# Altium project DRIVER MOTION_A.PrjPcb (part 2 of 2)

## Sheet [10]_MOT_tH-BDIGDE FOC.SchDoc
size A3; DocumentNumber: 10; SheetNumber: 10; SheetTotal: 12; Ngu?i ki?m tra: bangdd; Ngu?i thi?t k?: thannt114
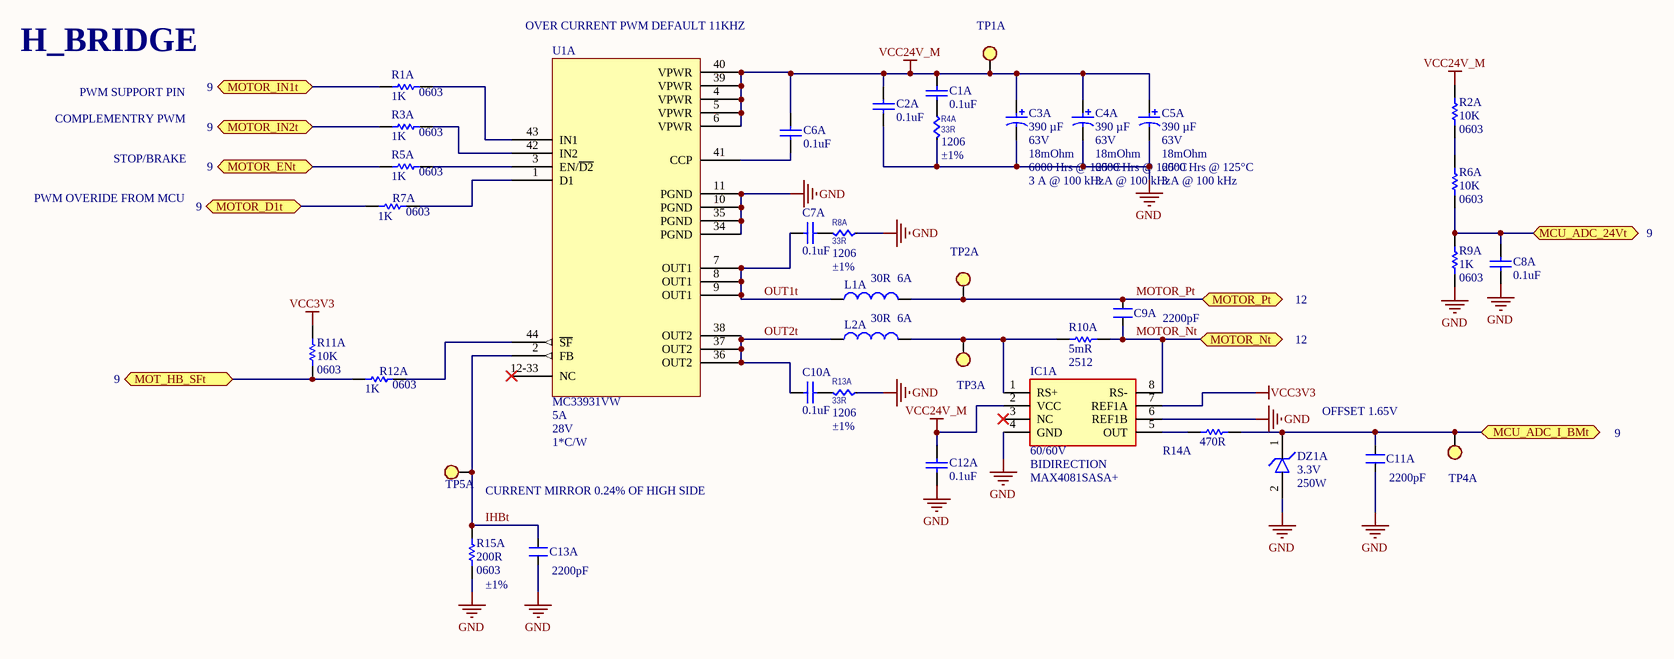
[diagram p6: [10]_MOT_tH-BDIGDE FOC.SchDoc]

### Parts
C1A  0.1uF  [CAP 0603]
C2A  0.1uF  [CAP 0603]
C3A  CPACITANCE: 390 µF  VOLTAGE: 63V  ESR: 18mOhm  Lifetime @ Temp.: 6000 Hrs @ 125°C  RIPPLE CURRENT: 3 A @ 100 kHz  [MAL218397005E3]  (hidden comment: HTK-35V391MHC5E-R2)
C4A  CPACITANCE: 390 µF  VOLTAGE: 63V  ESR: 18mOhm  Lifetime @ Temp.: 6000 Hrs @ 125°C  RIPPLE CURRENT: 3 A @ 100 kHz  [MAL218397005E3]  (hidden comment: HTK-35V391MHC5E-R2)
C5A  CPACITANCE: 390 µF  VOLTAGE: 63V  ESR: 18mOhm  Lifetime @ Temp.: 6000 Hrs @ 125°C  RIPPLE CURRENT: 3 A @ 100 kHz  [MAL218397005E3]  (hidden comment: HTK-35V391MHC5E-R2)
C6A  0.1uF  [CAP 0603]
C7A  0.1uF  [CAP 0603]
C8A  0.1uF  [CAP 0603]
C9A  2200pF  [CAP 0603]
C10A  0.1uF  [CAP 0603]
C11A  2200pF  [CAP 0603]
C12A  0.1uF  [CAP 0603]
C13A  2200pF  [CAP 0603]
DZ1A  Voltage - Reverse Standoff: 3.3V  Power - Peak Pulse: 250W  [SOD-323]  (hidden comment: ESD8351HT1G)
IC1A  GAIN: 60/60V  FUNCTION: BIDIRECTION  [8-SOIC]  (hidden comment: MAX4081SASA+)
L1A  Current: 6A  [R0805]  (hidden comment: 30R)
L2A  Current: 6A  [R0805]  (hidden comment: 30R)
R1A  PCB Footprint: 0603  [res 0603]  (hidden comment: 1K)
R2A  PCB Footprint: 0603  [res 0603]  (hidden comment: 10K)
R3A  PCB Footprint: 0603  [res 0603]  (hidden comment: 1K)
R4A  33R  PACKAGE: 1206  Tolerance: ±1%  [RES 1206]
R5A  PCB Footprint: 0603  [res 0603]  (hidden comment: 1K)
R6A  PCB Footprint: 0603  [res 0603]  (hidden comment: 10K)
R7A  PCB Footprint: 0603  [res 0603]  (hidden comment: 1K)
R8A  33R  PACKAGE: 1206  Tolerance: ±1%  [RES 1206]
R9A  PCB Footprint: 0603  [res 0603]  (hidden comment: 1K)
R10A  value 5mR  PCB Footprint: 2512  [res 2512]  (hidden comment: CRF2512-FZ-R005ELF)
R11A  PCB Footprint: 0603  [res 0603]  (hidden comment: 10K)
R12A  PCB Footprint: 0603  [res 0603]  (hidden comment: 1K)
R13A  33R  PACKAGE: 1206  Tolerance: ±1%  [RES 1206]
R14A  470R  [res 0603]
R15A  PCB Footprint: 0603  Tolerance: ±1%  [res 0603]  (hidden comment: 200R)
TP1A  TP SMD  [TESTPOINT]  (value not drawn)  (no BOM)
TP2A  TP SMD  [TESTPOINT]  (value not drawn)  (no BOM)
TP3A  TP SMD  [TESTPOINT]  (value not drawn)  (no BOM)
TP4A  TP SMD  [TESTPOINT]  (value not drawn)  (no BOM)
TP5A  TP SMD  [TESTPOINT]  (value not drawn)  (no BOM)
U1A  MC33931VW  CURRENT: 5A  MAX INPUT: 28V  THERMAL RESISTANCE: 1*C/W  [SOP44_FRE-M]

### Ports
MCU_ADC_24Vt (bidir, see 9), MCU_ADC_I_BMt (bidir, see 9), MOT_HB_SFt (bidir, see 9), MOTOR_D1t (bidir, see 9), MOTOR_ENt (bidir, see 9), MOTOR_IN1t (bidir, see 9), MOTOR_IN2t (bidir, see 9), MOTOR_Nt (bidir, see 12), MOTOR_Pt (bidir, see 12)

### Nets
GND: C2A.2 C3A.2 C4A.2 C5A.2 C8A.2 C11A.2 C12A.2 C13A.2 DZ1A.2 IC1A.4(GND) IC1A.6(REF1B) R4A.2 R8A.2 R9A.2 R13A.2 R15A.1 U1A.10(PGND) U1A.11(PGND) U1A.34(PGND) U1A.35(PGND)
VCC3V3: IC1A.7(REF1A) R11A.1
VCC24V_M: C1A.1 C2A.1 C3A.1 C4A.1 C5A.1 C6A.1 C12A.1 IC1A.2(VCC) R2A.2 TP1A.1 U1A.4(VPWR) U1A.5(VPWR) U1A.6(VPWR) U1A.39(VPWR) U1A.40(VPWR)
IHBt: C13A.1 R15A.2 TP5A.1 U1A.2(FB)
MCU_ADC_24Vt: C8A.1 R6A.1 R9A.1 ; port MCU_ADC_24Vt
MCU_ADC_I_BMt: C11A.1 DZ1A.1 R14A.2 TP4A.1 ; port MCU_ADC_I_BMt
MOT_HB_SFt: R11A.2 R12A.1 ; port MOT_HB_SFt
MOTOR_D1t: R7A.1 ; port MOTOR_D1t
MOTOR_ENt: R5A.1 ; port MOTOR_ENt
MOTOR_IN1t: R1A.1 ; port MOTOR_IN1t
MOTOR_IN2t: R3A.1 ; port MOTOR_IN2t
MOTOR_Nt: C9A.2 IC1A.8(RS-) R10A.2 ; port MOTOR_Nt
MOTOR_Pt: C9A.1 L1A.2 TP2A.1 ; port MOTOR_Pt
OUT1t: C7A.1 L1A.1 U1A.7(OUT1) U1A.8(OUT1) U1A.9(OUT1)
OUT2t: C10A.1 L2A.1 U1A.36(OUT2) U1A.37(OUT2) U1A.38(OUT2)
NetC1A_2: C1A.2 R4A.1
NetC6A_2: C6A.2 U1A.41(CCP)
NetC7A_2: C7A.2 R8A.1
NetC10A_2: C10A.2 R13A.1
NetIC1A_1: IC1A.1(RS+) L2A.2 R10A.1 TP3A.1
NetIC1A_5: IC1A.5(OUT) R14A.1
NetR1A_2: R1A.2 U1A.43(IN1)
NetR2A_1: R2A.1 R6A.2
NetR3A_2: R3A.2 U1A.42(IN2)
NetR5A_2: R5A.2 U1A.3(EN/~{D2})
NetR7A_2: R7A.2 U1A.1(D1)
NetR12A_2: R12A.2 U1A.44(~{SF})

Not connected (* = marked no-connect by the designer): IC1A 3(NC)*; U1A 12-33(NC)*

### Notes on the sheet
- H_BRIDGE
- (near U1A) OVER CURRENT PWM DEFAULT 11KHZ
- COMPLEMENTRY PWM
- PWM SUPPORT PIN
- PWM OVERIDE FROM MCU
- STOP/BRAKE
- OFFSET 1.65V
- CURRENT MIRROR 0.24% OF HIGH SIDE

### Library data of the parts
C1A C2A C6A C7A C8A C10A C12A = Cap: as C502 on sheet [5]_MOT_MCU MKV58; CATEGORY: CAP-CER; VALUE: 0.1uF; FOOTPRINT: 0603; Material: X7R; Voltage: 50V; Tolerance: ±10%; MANUFACTURER2: UWA
C3A C4A C5A = CAP-ALUM,SMD;470uF,20%,12.5x30,63V,287mOhm: HYBRID ECAP, 35V, 390UF, 30G VIB; MANUFACTURER1: Elna America; Manufacturer Part Number: MAL218397005E3; Category: CAP-POLY-SMD; MANUFACTURER1_PART#: HTK-35V391MHC5E-R2; VALUE: HTK-35V391MHC5E-R2; LINK: https://www.digikey.com/en/products/detail/elna-america/HTK-35V391MHC5E-R2/10129270; PRICE: 1.732
C9A C11A C13A = CN: CAP CER 2200PF 50V X7R 0603; MANUFACTURER1: Samsung Electro-Mechanics; MANUFACTURER1_PART#: CL10B222KB8NFNC; PACKING: TR; PCB FOOTPRINT: 0603; PROCESS_TYPE: SMT; Tolerance: ±10%; Value: 2200pF; CATEGORY: CAP CER; Voltage - Rated: 50V; Temperature Coefficient: X7R
DZ1A = TVS-DIODE;BI-DIR,600W,30V/48.4V,DO214AA,SMBJ30A-E3/52: TVS DIODE 3.3VWM 11.2VC SOD323; MANUFACTURER1: onsemi; Category: TVS; MANUFACTURER1_PART#: ESD8351HT1G; VALUE: ESD8351HT1G; LINK: https://www.digikey.com/en/products/detail/onsemi/ESD8351HT1G/5257577; PRICE: 0.16
IC1A = IC; IC CURR SENSE 1 CIRCUIT,8-SOIC,-40TO 125°C,LT1999HMS8-20#PBF: IC CURR SENSE 1 CIRCUIT 8SOIC; MANUFACTURER1: Maxim; Manufacturer Part Number: MAX4081SASA+; PRICE: 3.05000; MANUFACTURER1_PART#: MAX4081SASA+; LINK: https://www.digikey.com/en/products/detail/maxim-integrated/MAX4080SASA-T/1703910; Category: IC; NI_MARK: *; VALUE: MAX4081SASA+; MANUFACTURER2: *; MANUFACTURER2_PART#: *
L1A L2A = inductor 2.2uF: FIXED IND 6.8UH 2.3A 52 MOHM SMD; MANUFACTURER1: Murata; MANUFACTURER1_PART#: BLM21SN300SH1D; PACKING: Tape & Reel (TR); PCB Footprint: 0805; Process Type: SM; Unit: PCS; Tolerance: ±20%; CORE TYPE: FERRITE; Category: Inductor; Value: 30R
R1A R3A R5A R7A R9A R12A = Res0.3: as R508 on sheet [5]_MOT_MCU MKV58; Value: 1K; CATEGORY: RES SMD; MANUFACTURER2: UWA; Tolerance: ±5%
R2A R6A R11A = Res0.3: RES SMD,10K OHM 5% 1/10W 0603; MANUFACTURER1: Stackpole Electronics Inc; MANUFACTURER1_PART#: RMCF0603JT10K0; MANUFACTURER2_PART#: R0603J10KKDX; PACKING: Tape & Reel (TR); Process Type: SM; Unit: PCS; Power: 0.25W; Value: 10K; CATEGORY: RES-SMD; MANUFACTURER2: UWA; Tolerance: ±5%
R4A R8A R13A = RES 510R 1206 5%: RES 33 OHM 1% 1/4W 1206; MANUFACTURER1: Stackpole; MANUFACTURER1_PART#: RMCF1206FT33R0; PROCESS_TYPE: SMT; Power (Watts): 1/2W; Packaging: Tape and Reel; CATEGORY: RES; VALUE: 33R
R10A = Res0.3: RES 0.005 OHM 1% 2W 2512; MANUFACTURER1: Bourns; PACKING: Tape & Reel (TR); Process Type: SM; Unit: PCS; CATEGORY: RES SMD; MANUFACTURER1_PART#: CRF2512-FZ-R005ELF
R14A = Res0.3: RES SMD, 470 OHM 5% 1/8W 0603; MANUFACTURER1: KOA Speer Electronics, Inc.; MANUFACTURER1_PART#: RK73B1JTTD471J; MANUFACTURER2_PART#: RMCF0603JT470R; PACKING: Tape & Reel (TR); PCB Footprint: 0603; Process Type: SM; Unit: PCS; Power: 0.25W; Value: 470R; CATEGORY: RES SMD; MANUFACTURER2: Stackpole; Tolerance: ±5%
R15A = Res0.3: RES 200 OHM 1% 1/8W 0603; MANUFACTURER1: Stackpole Electronics Inc; MANUFACTURER1_PART#: RNCP0603FTD200R; MANUFACTURER2_PART#: RC0603FR-07200RL; DESCCRIPTION: RES SMD 1K OHM 5% 1/10W 0603; PACKING: Tape & Reel (TR); Process Type: SM; Unit: PCS; Power: 0.25W; Value: 200R; CATEGORY: RES SMD; MANUFACTURER2: YAGEO
TP1A TP2A TP3A TP4A TP5A = TP SMD: TEST POINT
U1A = MC33931VW IC MOTOR DRIVER 5V-28V 44HSOP: IC MOTOR DRIVER 5V-28V 44HSOP; MANUFACTURER1: NXP; LOH_CODE: *; MANUFACTURER1_PART#: MC33931VW; Value: MC33931VW; PRICE: 13.54000; LINK: https://www.digikey.com/en/products/detail/nxp-usa-inc/MC33931VW/2185657

## Sheet [11]_MOT_tCONTROL LED STATUS.SchDoc
size A3; DocumentNumber: 11; SheetNumber: 11; SheetTotal: 12
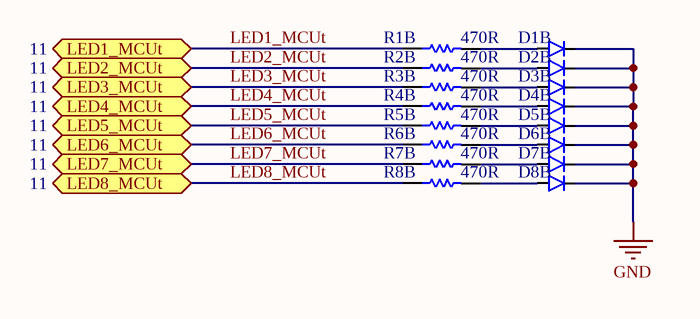
[diagram p7: [11]_MOT_tCONTROL LED STATUS.SchDoc]

### Parts
D1B  LED 0603  [LED0603]  (value not drawn)
D2B  LED 0603  [LED0603]  (value not drawn)
D3B  LED 0603  [LED0603]  (value not drawn)
D4B  LED 0603  [LED0603]  (value not drawn)
D5B  LED 0603  [LED0603]  (value not drawn)
D6B  LED 0603  [LED0603]  (value not drawn)
D7B  LED 0603  [LED0603]  (value not drawn)
D8B  LED 0603  [LED0603]  (value not drawn)
R1B  470R  [res 0603]
R2B  470R  [res 0603]
R3B  470R  [res 0603]
R4B  470R  [res 0603]
R5B  470R  [res 0603]
R6B  470R  [res 0603]
R7B  470R  [res 0603]
R8B  470R  [res 0603]

### Ports
LED1_MCUt (bidir, see 11), LED2_MCUt (bidir, see 11), LED3_MCUt (bidir, see 11), LED4_MCUt (bidir, see 11), LED5_MCUt (bidir, see 11), LED6_MCUt (bidir, see 11), LED7_MCUt (bidir, see 11), LED8_MCUt (bidir, see 11)

### Nets
GND: D1B.1(K) D2B.1(K) D3B.1(K) D4B.1(K) D5B.1(K) D6B.1(K) D7B.1(K) D8B.1(K)
LED1_MCUt: R1B.1 ; port LED1_MCUt
LED2_MCUt: R2B.1 ; port LED2_MCUt
LED3_MCUt: R3B.1 ; port LED3_MCUt
LED4_MCUt: R4B.1 ; port LED4_MCUt
LED5_MCUt: R5B.1 ; port LED5_MCUt
LED6_MCUt: R6B.1 ; port LED6_MCUt
LED7_MCUt: R7B.1 ; port LED7_MCUt
LED8_MCUt: R8B.1 ; port LED8_MCUt
NetD1B_2: D1B.2(A) R1B.2
NetD2B_2: D2B.2(A) R2B.2
NetD3B_2: D3B.2(A) R3B.2
NetD4B_2: D4B.2(A) R4B.2
NetD5B_2: D5B.2(A) R5B.2
NetD6B_2: D6B.2(A) R6B.2
NetD7B_2: D7B.2(A) R7B.2
NetD8B_2: D8B.2(A) R8B.2

### Library data of the parts
R1B R2B R3B R4B R5B R6B R7B R8B = Res0.3: as R14A on sheet [10]_MOT_tH-BDIGDE FOC; Value: 470R; CATEGORY: RES SMD; MANUFACTURER2: Stackpole; Tolerance: ±5%

## Sheet [12]_MOT_tCONNECTOR.SchDoc
size A3; DocumentNumber: 12; SheetNumber: 12; SheetTotal: 12; Ngu?i ki?m tra: bangdd; Ngu?i thi?t k?: thannt114
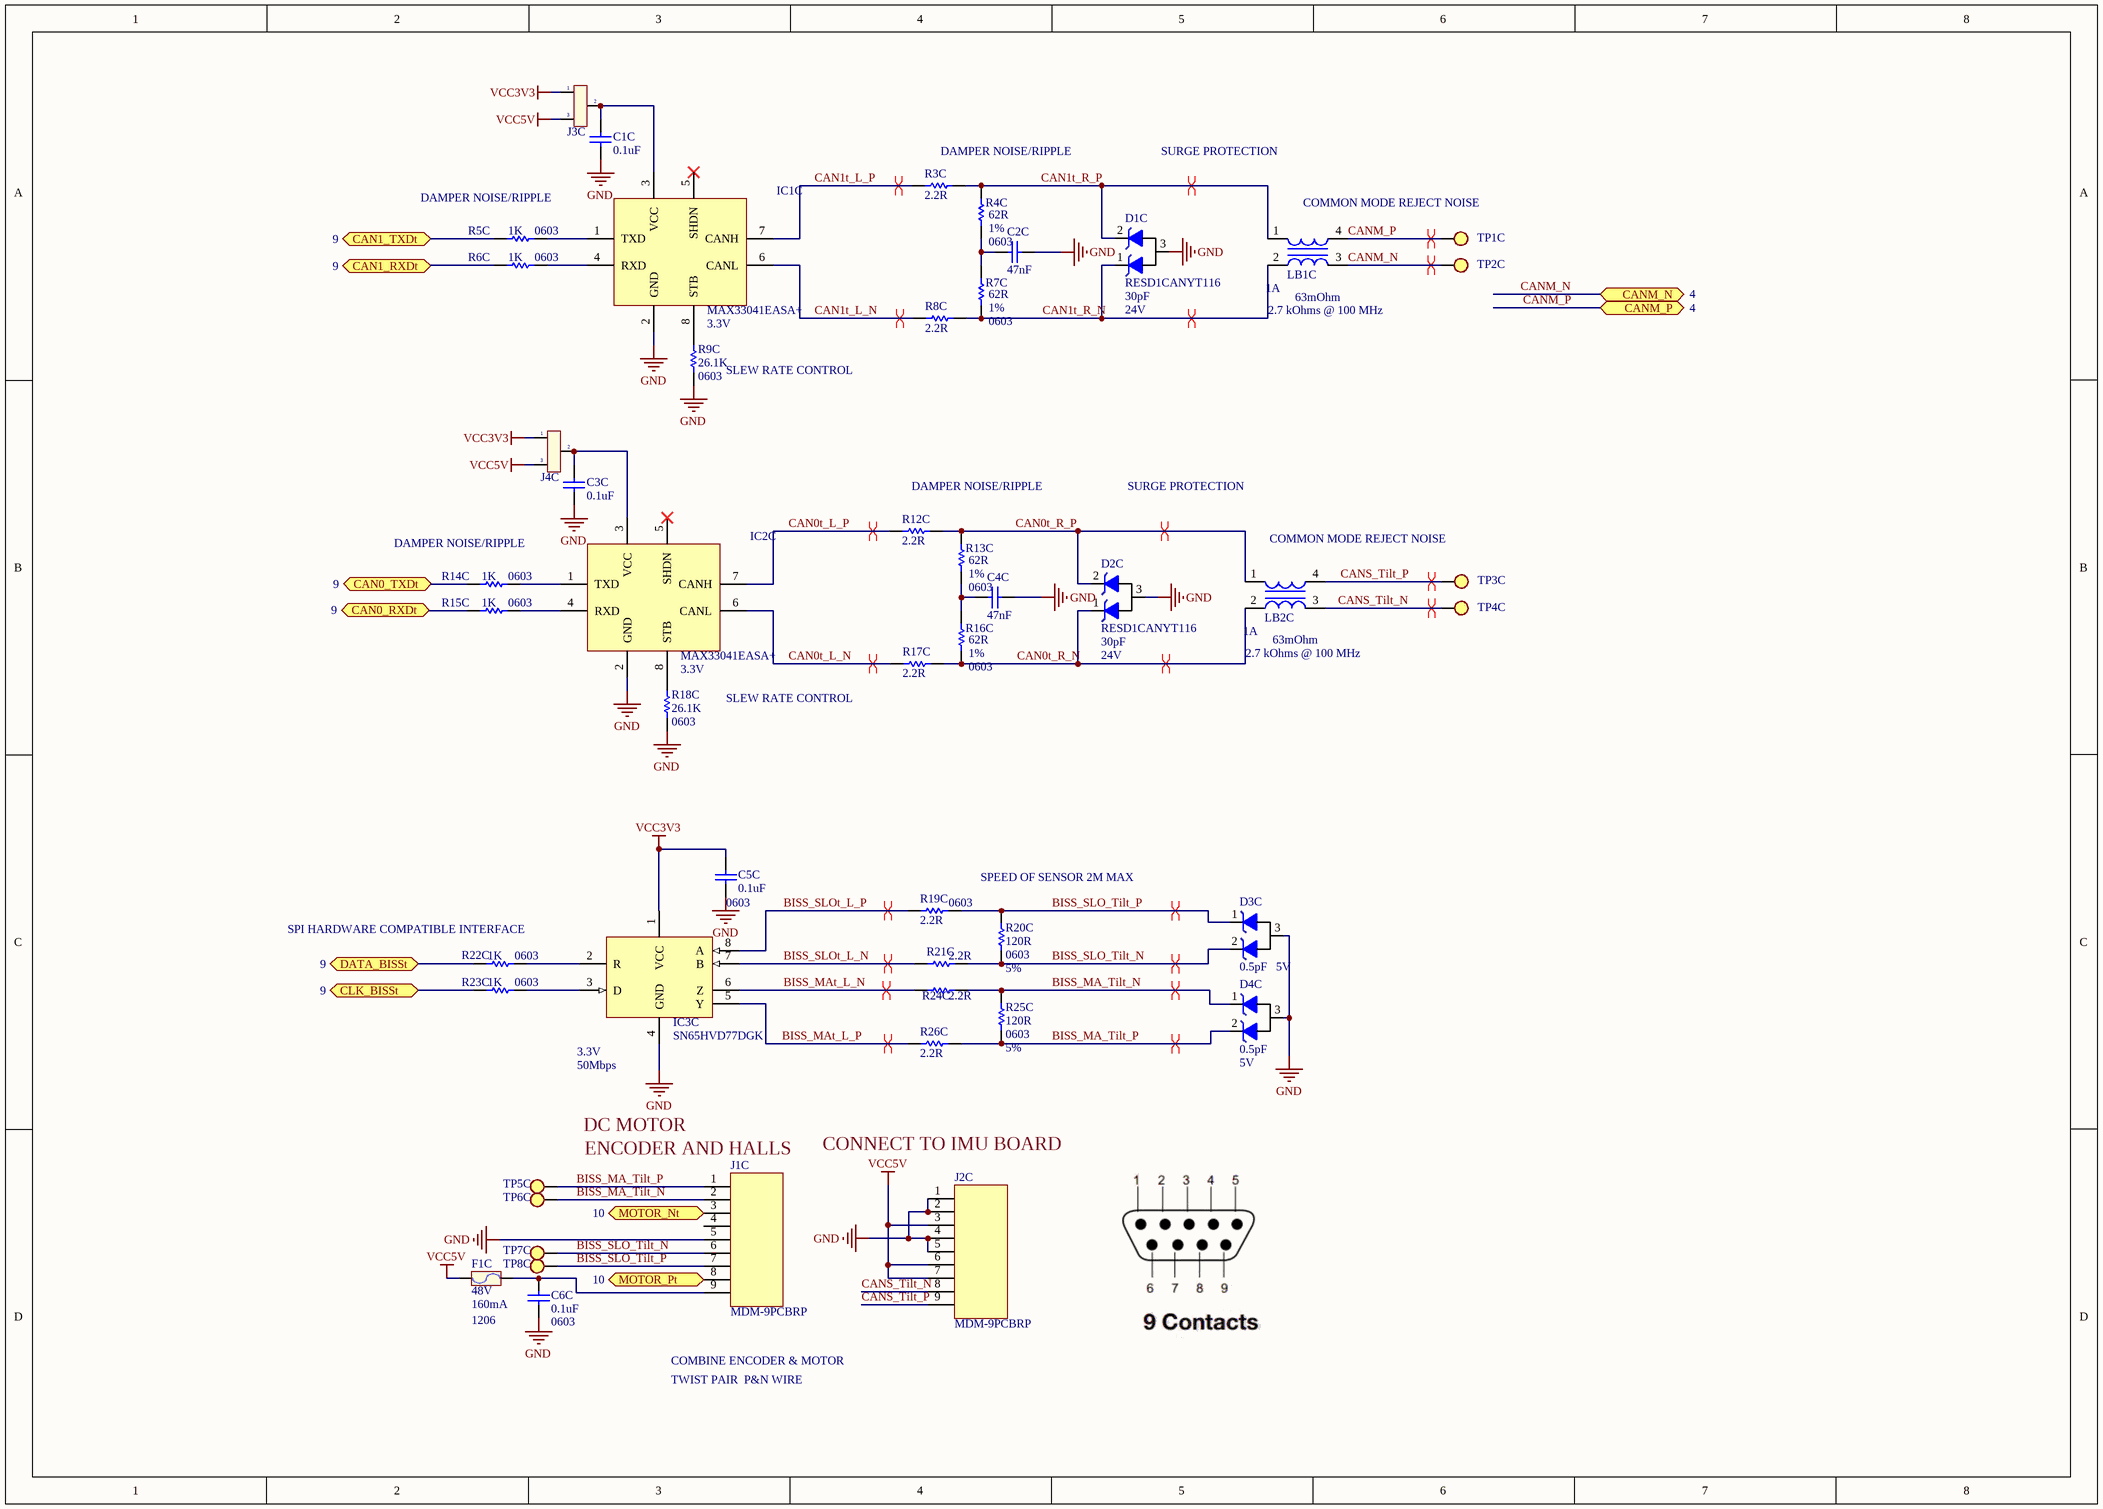
[diagram p8: [12]_MOT_tCONNECTOR.SchDoc]

### Parts
C1C  0.1uF  [CAP 0603]
C2C  47nF  [CAP 0603]
C3C  0.1uF  [CAP 0603]
C4C  47nF  [CAP 0603]
C5C  FOOTPRINT: 0603  [CAP 0603]  (hidden comment: 0.1uF)
C6C  FOOTPRINT: 0603  [CAP 0603]  (hidden comment: 0.1uF)
D1C  CAPACITANCE: 30pF  VOLTAGE: 24V  [SOT-23-3]  (hidden comment: RESD1CANYT116)
D2C  CAPACITANCE: 30pF  VOLTAGE: 24V  [SOT-23-3]  (hidden comment: RESD1CANYT116)
D3C  CAPACITANCE: 0.5pF  VOLTAGE: 5V  [SOT-416]  (hidden comment: ESDR0502BT1G)
D4C  CAPACITANCE: 0.5pF  VOLTAGE: 5V  [SOT-416]  (hidden comment: ESDR0502BT1G)
F1C  Voltage - Rated: 48V  Package / Case: 1206  Current Rating (Amps): 160mA  [RES 1206]  (hidden comment: 0ZCG0014FF2C)
IC1C  VOLTAGE: 3.3V  [8-SOIC]  (hidden comment: MAX33041EASA+)
IC2C  VOLTAGE: 3.3V  [8-SOIC]  (hidden comment: MAX33041EASA+)
IC3C  Manufacturer Part Number: SN65HVD77DGK  VOLTAGE: 3.3V  SPEED: 50Mbps  [8-VSSOP]  (hidden comment: IC;IC TRANSCEIVER FULL 1/1 8SOIC,8-SOIC,-40TO 85°C,SN65HVD77DR)
J1C  CONN-DIP;CONN MICRO-D PLUG 9POS R/A SLDR,M,MDM-9PCBRP  [MDM-9PCBRP]  (value not drawn)
J2C  CONN-DIP;CONN MICRO-D PLUG 9POS R/A SLDR,M,MDM-9PCBRP  [MDM-9PCBRP]  (value not drawn)
J3C  JP 2-1  [JP3]  (value not drawn)
J4C  JP 2-1  [JP3]  (value not drawn)
LB1C  CURRENT: 1A  IMPEDANCE: 2.7 kOhms @ 100 MHz  DCR: 63mOhm  [MCM-7060M]  (hidden comment: MCM-7060M-272-RU)
LB2C  CURRENT: 1A  IMPEDANCE: 2.7 kOhms @ 100 MHz  DCR: 63mOhm  [MCM-7060M]  (hidden comment: MCM-7060M-272-RU)
R3C  2.2R  [res 0603]
R4C  TOLERANCE: 1%  PACKAGE: 0603  [R0603]  (hidden comment: 62R)
R5C  PCB Footprint: 0603  [res 0603]  (hidden comment: 1K)
R6C  PCB Footprint: 0603  [res 0603]  (hidden comment: 1K)
R7C  TOLERANCE: 1%  PACKAGE: 0603  [R0603]  (hidden comment: 62R)
R8C  2.2R  [res 0603]
R9C  PCB Footprint: 0603  [R0603]  (hidden comment: 26.1K)
R12C  2.2R  [res 0603]
R13C  TOLERANCE: 1%  PACKAGE: 0603  [R0603]  (hidden comment: 62R)
R14C  PCB Footprint: 0603  [res 0603]  (hidden comment: 1K)
R15C  PCB Footprint: 0603  [res 0603]  (hidden comment: 1K)
R16C  TOLERANCE: 1%  PACKAGE: 0603  [R0603]  (hidden comment: 62R)
R17C  2.2R  [res 0603]
R18C  PCB Footprint: 0603  [R0603]  (hidden comment: 26.1K)
R19C  PCB Footprint: 0603  [res 0603]  (hidden comment: 2.2R)
R20C  PCB_ Footprint: 0603  Tolerance: 5%  [res 0603]  (hidden comment: 120R)
R21C  2.2R  [res 0603]
R22C  PCB Footprint: 0603  [res 0603]  (hidden comment: 1K)
R23C  PCB Footprint: 0603  [res 0603]  (hidden comment: 1K)
R24C  2.2R  [res 0603]
R25C  PCB_ Footprint: 0603  Tolerance: 5%  [res 0603]  (hidden comment: 120R)
R26C  2.2R  [res 0603]
TP1C  TP SMD  [TESTPOINT]  (value not drawn)  (no BOM)
TP2C  TP SMD  [TESTPOINT]  (value not drawn)  (no BOM)
TP3C  TP SMD  [TESTPOINT]  (value not drawn)  (no BOM)
TP4C  TP SMD  [TESTPOINT]  (value not drawn)  (no BOM)
TP5C  TP SMD  [TESTPOINT]  (value not drawn)  (no BOM)
TP6C  TP SMD  [TESTPOINT]  (value not drawn)  (no BOM)
TP7C  TP SMD  [TESTPOINT]  (value not drawn)  (no BOM)
TP8C  TP SMD  [TESTPOINT]  (value not drawn)  (no BOM)

### Ports
CAN0_RXDt (bidir, see 9), CAN0_TXDt (bidir, see 9), CAN1_RXDt (bidir, see 9), CAN1_TXDt (bidir, see 9), CANM_N (bidir, see 4), CANM_P (bidir, see 4), CLK_BISSt (bidir, see 9), DATA_BISSt (bidir, see 9), MOTOR_Nt (bidir, see 10), MOTOR_Pt (bidir, see 10)

### Nets
GND: C1C.2 C2C.2 C3C.2 C4C.2 C5C.2 C6C.2 D1C.3(A) D2C.3(A) D3C.3(A) D4C.3(A) IC1C.2(GND) IC2C.2(GND) IC3C.4(GND) J1C.5 J2C.1 J2C.2 J2C.4 J2C.5 R9C.2 R18C.2
VCC3V3: C5C.1 IC3C.1(VCC) J3C.1 J4C.1
VCC5V: F1C.2 J2C.3 J2C.6 J2C.7 J3C.3 J4C.3
BISS_MA_Tilt_N: D4C.1(K) J1C.2 R24C.1 R25C.1 TP6C.1
BISS_MA_Tilt_P: D4C.2(K) J1C.1 R25C.2 R26C.1 TP5C.1
BISS_MAt_L_N: IC3C.6(Z) R24C.2
BISS_MAt_L_P: IC3C.5(Y) R26C.2
BISS_SLO_Tilt_N: D3C.2(K) J1C.6 R20C.2 R21C.1 TP7C.1
BISS_SLO_Tilt_P: D3C.1(K) J1C.7 R19C.1 R20C.1 TP8C.1
BISS_SLOt_L_N: IC3C.7(B) R21C.2
BISS_SLOt_L_P: IC3C.8(A) R19C.2
CAN0_RXDt: R15C.2 ; port CAN0_RXDt
CAN0_TXDt: R14C.2 ; port CAN0_TXDt
CAN0t_L_N: IC2C.6(CANL) R17C.2
CAN0t_L_P: IC2C.7(CANH) R12C.2
CAN0t_R_N: D2C.1(K) LB2C.2 R16C.1 R17C.1
CAN0t_R_P: D2C.2(K) LB2C.1 R12C.1 R13C.2
CAN1_RXDt: R6C.2 ; port CAN1_RXDt
CAN1_TXDt: R5C.2 ; port CAN1_TXDt
CAN1t_L_N: IC1C.6(CANL) R8C.2
CAN1t_L_P: IC1C.7(CANH) R3C.2
CAN1t_R_N: D1C.1(K) LB1C.2 R7C.1 R8C.1
CAN1t_R_P: D1C.2(K) LB1C.1 R3C.1 R4C.2
CANM_N: LB1C.3 TP2C.1 ; port CANM_N
CANM_P: LB1C.4 TP1C.1 ; port CANM_P
CANS_Tilt_N: J2C.8 LB2C.3 TP4C.1
CANS_Tilt_P: J2C.9 LB2C.4 TP3C.1
CLK_BISSt: R23C.2 ; port CLK_BISSt
DATA_BISSt: R22C.2 ; port DATA_BISSt
MOTOR_Nt: J1C.3 ; port MOTOR_Nt
MOTOR_Pt: J1C.8 ; port MOTOR_Pt
NetC1C_1: C1C.1 IC1C.3(VCC) J3C.2
NetC2C_1: C2C.1 R4C.1 R7C.2
NetC3C_1: C3C.1 IC2C.3(VCC) J4C.2
NetC4C_1: C4C.1 R13C.1 R16C.2
NetC6C_1: C6C.1 F1C.1 J1C.9
NetIC1C_1: IC1C.1(TXD) R5C.1
NetIC1C_4: IC1C.4(RXD) R6C.1
NetIC1C_8: IC1C.8(STB) R9C.1
NetIC2C_1: IC2C.1(TXD) R14C.1
NetIC2C_4: IC2C.4(RXD) R15C.1
NetIC2C_8: IC2C.8(STB) R18C.1
NetIC3C_2: IC3C.2(R) R22C.1
NetIC3C_3: IC3C.3(D) R23C.1

Not connected (* = marked no-connect by the designer): IC1C 5(SHDN)*; IC2C 5(SHDN)*; J1C 4

### Layout directives
differential pair: BISS_MA_Tilt_N, BISS_MA_Tilt_P, BISS_MAt_L_N, BISS_MAt_L_P, BISS_SLO_Tilt_N, BISS_SLO_Tilt_P, BISS_SLOt_L_N, BISS_SLOt_L_P, CAN0t_L_N, CAN0t_L_P, CAN0t_R_N, CAN0t_R_P, CAN1t_L_N, CAN1t_L_P, CAN1t_R_N, CAN1t_R_P, CANM_N, CANM_P, CANS_Tilt_N, CANS_Tilt_P

### Notes on the sheet
- DAMPER NOISE/RIPPLE
- SURGE PROTECTION
- (near R5C) DAMPER NOISE/RIPPLE
- COMMON MODE REJECT NOISE
- (near R9C) SLEW RATE CONTROL
- (near R14C) DAMPER NOISE/RIPPLE
- SLEW RATE CONTROL
- SPEED OF SENSOR 2M MAX
- (near R22C) SPI HARDWARE COMPATIBLE INTERFACE
- DC MOTOR
- (near J1C) ENCODER AND HALLS
- (near J2C) CONNECT TO IMU BOARD
- COMBINE ENCODER & MOTOR
- TWIST PAIR  P&N WIRE

### Library data of the parts
C1C C3C = Cap: CAP-CER,SMD;0.1UF,10%,50V,X7R,0603; MANUFACTURER1: Samsung Electro-Mechanics; MANUFACTURER1_PART#: CL10B104KB8NNNC; MANUFACTURER2_PART#: M0603X104K050TAX; MANUFACTURER1: SS; Unit: PCS; PACKING: Tape & Reel (TR); PCB FOOTPRINT: 0603; Process Type: SM; CATEGORY: CAP-CER; VALUE: 0.1uF; FOOTPRINT: 0603; Material: X7R; Voltage: 50V; Tolerance: ±10%; MANUFACTURER2: UWA
C2C C4C = Cap: CAP-CER,SMD; 47nF,10%,50V,X7R,0603; MANUFACTURER1: Meritek; MANUFACTURER1_PART#: MA0603XR473K500; MANUFACTURER2_PART#: C0603X7R500-473KNE; Unit: PCS; PACKING: Tape & Reel (TR); PCB FOOTPRINT: 0603; Process Type: SM; CATEGORY: CAP-CER; VALUE: 47nF; FOOTPRINT: 0603; Material: X7R; Voltage: 50V; Tolerance: ±10%; MANUFACTURER2: Venkel
C5C C6C = Cap: CAP-CER,SMD;0.1UF,10%,50V,X7R,0603; MANUFACTURER1: Samsung Electro-Mechanics; MANUFACTURER1_PART#: CL10B104KB8NNNC; MANUFACTURER2_PART#: M0603X104K050TAX; MANUFACTURER1: SS; Unit: PCS; PACKING: Tape & Reel (TR); Process Type: SM; CATEGORY: CAP-CER; VALUE: 0.1uF; Material: X7R; Voltage: 50V; PCB FOOTPRINT: 0603; Tolerance: ±10%; MANUFACTURER2: UWA
D1C D2C = TVS_DUAL_SIGNAL_5V_SOT23: TVS DIODE 24VWM 50VC SOT23-; MANUFACTURER1: Littelfuse; CURRENT: 10A; POWER: 230W; Category: TVS; MANUFACTURER1_PART#: RESD1CANYT116; Value: RESD1CANYT116; LOH_CODE: *; LINK: https://www.digikey.com/en/products/detail/littelfuse-inc/SM24CANB-02HTG/5048174?s=N4IgTCBcDaIMoFkwBYDCBBAcgIQLQAYwAJAFQHEQBdAXyA; PRICE: 0.78000
D3C D4C = TVS_DUAL_SIGNAL_5V_SOT23: 5V, ESD PROTECTION DEVICES, SOT-23; MANUFACTURER2_PART#: DF3D6.8MS,LF; MANUFACTURER1: ON Semiconductor; CURRENT: 1A; POWER: 320W; Category: TVS; MANUFACTURER1_PART#: ESDR0502BT1G; MANUFACTURER2: Toshiba; Value: ESDR0502BT1G; LOH_CODE: *
F1C = 0875.800MXEP: PTC RESET FUSE 48V 160MA 1206; MANUFACTURER1_PART#: 0ZCJ0016FF2E; MANUFACTURER2_PART#: CLA1684; MANUFACTURER1: Bel Fuse; PROCESS_TYPE: SM; Unit: PCS; Response Time: 8ms; Breaking Capacity @ Rated Voltage: 10A; DC Cold Resistance: 1.1 Ohms; CATEGORY: FUSE; MANUFACTURER2: https://linhkienchatluong.vn/cau-chi-tu-phuc-hoi-ptc/cau-chi-tu-phuc-hoi-1206-01a-60v-ptc-smd_sp845_ct4084.aspx; Value: 0ZCG0014FF2C
IC1C IC2C = IC;IC CAN TRANSEIVER HS,8SOIC,-40TO150°C,TJA1042T/3,118: IC CAN TXRX 3.3V 2MBPS SOIC; MANUFACTURER1: Maxim; Manufacturer Part Number: MAX33041EASA+; VALUE: MAX33041EASA+; Category: IC; MANUFACTURER1_PART#: MAX33041EASA+; LINK: https://www.digikey.com/en/products/detail/maxim-integrated/MAX33041EASA/15286828; PRICE: 3.5700
IC3C = IC;IC TRANSCEIVER FULL 1/1 8SOIC,8-SOIC,-40TO 85°C,SN65HVD77DR: IC TRANSCEIVER FULL 1/1 8VSSOP; Manufacturer: TI; MANUFACTURER1: Texas Instruments; VALUE: SN65HVD77DGK; Category: IC; LINK: https://www.digikey.com/en/products/detail/texas-instruments/SN65HVD77DR/4965743; PRICE: 3.623; MANUFACTURER1_PART#: SN65HVD77DGK
J1C J2C = CONN-DIP;CONN MICRO-D PLUG 9POS R/A SLDR,M,MDM-9PCBRP: CONN MICRO-D PLUG 9POS R/A SLDR; Manufacturer: ITT CANNON, LLC; Manufacturer Part Number: MDM-9PCBRP; MANUFACTURER1: ITT CANNON, LLC; MANUFACTURER1_PART#: MDM-9PCBRP
  J1C: Category: CONN
  J2C: CATEGORY: CONN
J3C J4C = JP 2-1: Jumper 2-1; Value: J2-1
LB1C LB2C = CHOKE-SMD;90OHM@100MHz,0.15A,5V,DLP11SA900HL2L: CMC 1A 2LN 2.7KOHM SMD; MANUFACTURER1: Mag Layers; VALUE: MCM-7060M-272-RU; LINK: https://www.digikey.com/en/products/detail/mag-layers/MCM-7060M-272-RU/13910475; MANUFACTURER1_PART#: MCM-7060M-272-RU; NI_MARK: *; MANUFACTURER2_PART#: *; MANUFACTURER2: *; Category: CHOKE; PRICE: 0.60000; PACKAGE: (7.50mm x 6.00mm)
R3C R8C R12C R17C R21C R24C R26C = Res0.3: RES SMD 2.2 OHM 5% 1/10W 0603; MANUFACTURER1: Yageo; MANUFACTURER1_PART#: RC0603JR-072R2L; MANUFACTURER2_PART#: RMCF0603JT2R20; PACKING: Tape & Reel (TR); PCB Footprint: 0603; Process Type: SM; Unit: PCS; Power: 0.25W; Value: 2.2R; CATEGORY: RES-SMD; MANUFACTURER2: Stackpole Electronics Inc; Tolerance: ±5%
R4C R7C R13C R16C = RES-SMD;60.4OHM,1%,0402,1/10W: RES SM 62 OHM 1% 1/10W 0603; MANUFACTURER1: Stackpole; MANUFACTURER1_PART#: RMCF0603FT62R0; MANUFACTURER2_PART#: RC0603FR-0762RL; VALUE: 62R; Category: RES-SMD; MANUFACTURER2: YAGEO
R5C R6C R14C R15C R22C R23C = Res0.3: RES SMD,1K OHM,5%,1/10W,0603; MANUFACTURER1: Stackpole Electronics Inc; MANUFACTURER1_PART#: RMCF06031K00JNEAC; MANUFACTURER2_PART#: R0603J1KTG; DESCCRIPTION: RES SMD 1K OHM 5% 1/10W 0603; PACKING: Tape & Reel (TR); Process Type: SM; Unit: PCS; LOH_Code: 140100083; Power: 0.25W; Value: 1K; CATEGORY: RES SMD; MANUFACTURER2: UWA; Tolerance: ±5%
R9C R18C = Res0.3: RES 26.1K OHM 1% 1/10W 0603; MANUFACTURER1: Stackpole Electronics Inc; MANUFACTURER1_PART#: RMCF0603FT26K1; MANUFACTURER2_PART#: RC0603FR-0726K1L; PACKING: Tape & Reel (TR); Process Type: SM; Unit: PCS; Power: 0.25W; Value: 26.1K; CATEGORY: RES-SMD; MANUFACTURER2: YAGEO; Tolerance: ±1%
R19C = Res0.3: RES SMD 2.2 OHM 5% 1/10W 0603; MANUFACTURER1: Yageo; MANUFACTURER1_PART#: RC0603JR-072R2L; MANUFACTURER2_PART#: RMCF0603JT2R20; PACKING: Tape & Reel (TR); Process Type: SM; Unit: PCS; Power: 0.25W; Value: 2.2R; CATEGORY: RES-SMD; MANUFACTURER2: Stackpole Electronics Inc; Tolerance: ±5%
R20C R25C = RES 120 OHM 5% 1/10W 0603: MANUFACTURER1: Stackpole; MANUFACTURER1_PART#: RMCF0603JG120R; PROC: SM; Unit: PCS; CATEGORY: RES-SMD; VALUE: 120R; FOOTPRINT: 0603
TP1C TP2C TP3C TP4C TP5C TP6C TP7C TP8C = TP SMD: TEST POINT

## Nets that join several sheets
24V: [4]_MOT_POWER (8 pins), [6]_MOT_H-BDIGDE FOC (L601.1 R602.1 R603.2)
GND: [4]_MOT_POWER (28 pins), [5]_MOT_MCU MKV58 (37 pins), [6]_MOT_H-BDIGDE FOC (20 pins), [7]_MOT_CONTROL LED STATUS (8 pins), [8]_MOT_CONNECTOR (20 pins), [9]_MOT_tMCU MKV58 (37 pins), [10]_MOT_tH-BDIGDE FOC (20 pins), [11]_MOT_tCONTROL LED STATUS (8 pins), [12]_MOT_tCONNECTOR (20 pins)
VADD: [4]_MOT_POWER (5 pins), [5]_MOT_MCU MKV58 (C501.1 C509.1 IC501.22 IC501.23), [9]_MOT_tMCU MKV58 (C901.1 C902.1 IC901.22 IC901.23)
VCC3V3: [4]_MOT_POWER (5 pins), [5]_MOT_MCU MKV58 (24 pins), [6]_MOT_H-BDIGDE FOC (IC601.7 R612.1), [8]_MOT_CONNECTOR (C805.1 IC803.1 J801.1 J802.1), [9]_MOT_tMCU MKV58 (24 pins), [10]_MOT_tH-BDIGDE FOC (IC1A.7 R11A.1), [12]_MOT_tCONNECTOR (C5C.1 IC3C.1 J3C.1 J4C.1)
VCC5V: [4]_MOT_POWER (7 pins), [5]_MOT_MCU MKV58 (C510.1 C514.2 J501.2 U502.8), [8]_MOT_CONNECTOR (6 pins), [9]_MOT_tMCU MKV58 (C910.1 C915.2 J901.2 U902.8), [12]_MOT_tCONNECTOR (6 pins)
VCC24V_M: [6]_MOT_H-BDIGDE FOC (16 pins), [10]_MOT_tH-BDIGDE FOC (15 pins)
CAN0_RXD: [5]_MOT_MCU MKV58 (IC501.63 JP501.1), [8]_MOT_CONNECTOR (R811.2)
CAN0_RXDt: [9]_MOT_tMCU MKV58 (IC901.63 JP?.1), [12]_MOT_tCONNECTOR (R15C.2)
CAN0_TXD: [5]_MOT_MCU MKV58 (IC501.62 JP501.2), [8]_MOT_CONNECTOR (R810.2)
CAN0_TXDt: [9]_MOT_tMCU MKV58 (IC901.62 JP?.2), [12]_MOT_tCONNECTOR (R14C.2)
CAN1_RXD: [5]_MOT_MCU MKV58 (IC501.90), [8]_MOT_CONNECTOR (R804.2)
CAN1_RXDt: [9]_MOT_tMCU MKV58 (IC901.90), [12]_MOT_tCONNECTOR (R6C.2)
CAN1_TXD: [5]_MOT_MCU MKV58 (IC501.91), [8]_MOT_CONNECTOR (R803.2)
CAN1_TXDt: [9]_MOT_tMCU MKV58 (IC901.91), [12]_MOT_tCONNECTOR (R5C.2)
CANM_N: [4]_MOT_POWER (P402.15 P402.16), [8]_MOT_CONNECTOR (LB801.3 TP802.1), [12]_MOT_tCONNECTOR (LB1C.3 TP2C.1)
CANM_P: [4]_MOT_POWER (P402.13 P402.14), [8]_MOT_CONNECTOR (LB801.4 TP801.1), [12]_MOT_tCONNECTOR (LB1C.4 TP1C.1)
CLK_BISS: [5]_MOT_MCU MKV58 (IC501.77), [8]_MOT_CONNECTOR (R819.2)
CLK_BISSt: [9]_MOT_tMCU MKV58 (IC901.77), [12]_MOT_tCONNECTOR (R23C.2)
DATA_BISS: [5]_MOT_MCU MKV58 (IC501.79), [8]_MOT_CONNECTOR (R818.2)
DATA_BISSt: [9]_MOT_tMCU MKV58 (IC901.79), [12]_MOT_tCONNECTOR (R22C.2)
LED1_MCU: [5]_MOT_MCU MKV58 (IC501.10), [7]_MOT_CONTROL LED STATUS (R701.1)
LED1_MCUt: [9]_MOT_tMCU MKV58 (IC901.10), [11]_MOT_tCONTROL LED STATUS (R1B.1)
LED2_MCU: [5]_MOT_MCU MKV58 (IC501.11), [7]_MOT_CONTROL LED STATUS (R702.1)
LED2_MCUt: [9]_MOT_tMCU MKV58 (IC901.11), [11]_MOT_tCONTROL LED STATUS (R2B.1)
LED3_MCU: [5]_MOT_MCU MKV58 (IC501.12), [7]_MOT_CONTROL LED STATUS (R703.1)
LED3_MCUt: [9]_MOT_tMCU MKV58 (IC901.12), [11]_MOT_tCONTROL LED STATUS (R3B.1)
LED4_MCU: [5]_MOT_MCU MKV58 (IC501.13), [7]_MOT_CONTROL LED STATUS (R704.1)
LED4_MCUt: [9]_MOT_tMCU MKV58 (IC901.13), [11]_MOT_tCONTROL LED STATUS (R4B.1)
LED5_MCU: [5]_MOT_MCU MKV58 (IC501.16), [7]_MOT_CONTROL LED STATUS (R705.1)
LED5_MCUt: [9]_MOT_tMCU MKV58 (IC901.16), [11]_MOT_tCONTROL LED STATUS (R5B.1)
LED6_MCU: [5]_MOT_MCU MKV58 (IC501.17), [7]_MOT_CONTROL LED STATUS (R706.1)
LED6_MCUt: [9]_MOT_tMCU MKV58 (IC901.17), [11]_MOT_tCONTROL LED STATUS (R6B.1)
LED7_MCU: [5]_MOT_MCU MKV58 (IC501.31), [7]_MOT_CONTROL LED STATUS (R707.1)
LED7_MCUt: [9]_MOT_tMCU MKV58 (IC901.31), [11]_MOT_tCONTROL LED STATUS (R7B.1)
LED8_MCU: [5]_MOT_MCU MKV58 (IC501.32), [7]_MOT_CONTROL LED STATUS (R708.1)
LED8_MCUt: [9]_MOT_tMCU MKV58 (IC901.32), [11]_MOT_tCONTROL LED STATUS (R8B.1)
MCU_ADC_24V: [5]_MOT_MCU MKV58 (IC501.14), [6]_MOT_H-BDIGDE FOC (C608.1 R607.1 R610.1)
MCU_ADC_24Vt: [9]_MOT_tMCU MKV58 (IC901.14), [10]_MOT_tH-BDIGDE FOC (C8A.1 R6A.1 R9A.1)
MCU_ADC_I_BM: [5]_MOT_MCU MKV58 (IC501.7), [6]_MOT_H-BDIGDE FOC (C611.1 DZ601.1 R615.2 TP604.1)
MCU_ADC_I_BMt: [9]_MOT_tMCU MKV58 (IC901.7), [10]_MOT_tH-BDIGDE FOC (C11A.1 DZ1A.1 R14A.2 TP4A.1)
MOT_HB_SF: [5]_MOT_MCU MKV58 (IC501.99), [6]_MOT_H-BDIGDE FOC (R612.2 R613.1)
MOT_HB_SFt: [9]_MOT_tMCU MKV58 (IC901.99), [10]_MOT_tH-BDIGDE FOC (R11A.2 R12A.1)
MOTOR_D1: [5]_MOT_MCU MKV58 (IC501.98), [6]_MOT_H-BDIGDE FOC (R608.1)
MOTOR_D1t: [9]_MOT_tMCU MKV58 (IC901.98), [10]_MOT_tH-BDIGDE FOC (R7A.1)
MOTOR_EN: [5]_MOT_MCU MKV58 (IC501.97), [6]_MOT_H-BDIGDE FOC (R606.1)
MOTOR_ENt: [9]_MOT_tMCU MKV58 (IC901.97), [10]_MOT_tH-BDIGDE FOC (R5A.1)
MOTOR_IN1: [5]_MOT_MCU MKV58 (IC501.95), [6]_MOT_H-BDIGDE FOC (R601.1)
MOTOR_IN1t: [9]_MOT_tMCU MKV58 (IC901.95), [10]_MOT_tH-BDIGDE FOC (R1A.1)
MOTOR_IN2: [5]_MOT_MCU MKV58 (IC501.96), [6]_MOT_H-BDIGDE FOC (R604.1)
MOTOR_IN2t: [9]_MOT_tMCU MKV58 (IC901.96), [10]_MOT_tH-BDIGDE FOC (R3A.1)
MOTOR_N: [6]_MOT_H-BDIGDE FOC (C609.2 IC601.8 R611.2), [8]_MOT_CONNECTOR (J803.3)
MOTOR_Nt: [10]_MOT_tH-BDIGDE FOC (C9A.2 IC1A.8 R10A.2), [12]_MOT_tCONNECTOR (J1C.3)
MOTOR_P: [6]_MOT_H-BDIGDE FOC (C609.1 L602.2 TP602.1), [8]_MOT_CONNECTOR (J803.8)
MOTOR_Pt: [10]_MOT_tH-BDIGDE FOC (C9A.1 L1A.2 TP2A.1), [12]_MOT_tCONNECTOR (J1C.8)
NetR401_1: [4]_MOT_POWER (R401.1), [5]_MOT_MCU MKV58 (R503.1), [9]_MOT_tMCU MKV58 (R903.1)